# Altium project Individual Assignment.PrjPcb
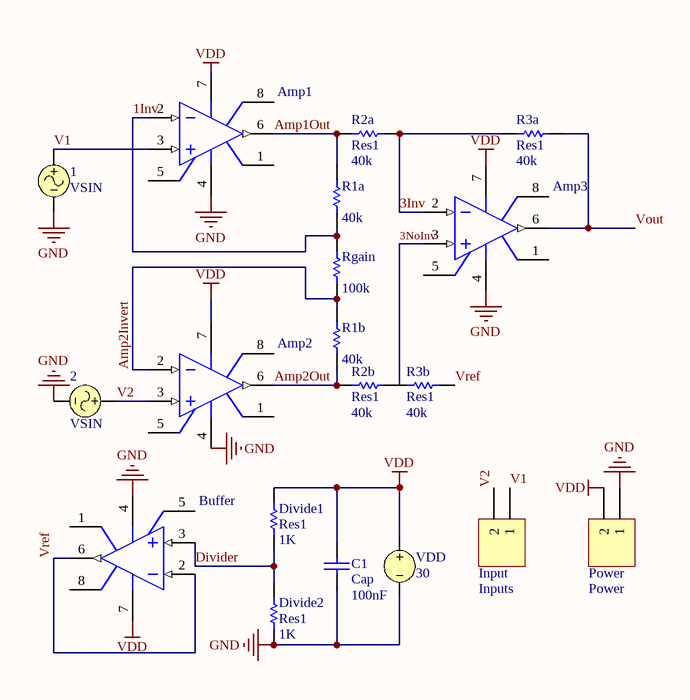
[diagram p0: Sheet1.SchDoc]
1 sheet, 19 parts. Net scope: global (net labels, ports and power ports of the same name join across sheets).
Board file: PCB1.PcbDoc

## Sheet Sheet1.SchDoc
size A

### Parts
1  VSIN
2  VSIN
Amp1  Op Amp  [H-08A]  (value not drawn)
Amp2  Op Amp  [H-08A]  (value not drawn)
Amp3  Op Amp  [H-08A]  (value not drawn)
Buffer  Op Amp  [H-08A]  (value not drawn)
C1  Cap  value 100nF  [RAD-0.3]
Divide1  Res1  value 1K  [AXIAL-0.3]
Divide2  Res1  value 1K  [AXIAL-0.3]
Input  Inputs  [HDR1X2]
Power  Power  [HDR1X2]
R1a  40k  [AXIAL-0.3]
R1b  40k  [AXIAL-0.3]
R2a  Res1  value 40k  [AXIAL-0.3]
R2b  Res1  value 40k  [AXIAL-0.3]
R3a  Res1  value 40k  [AXIAL-0.3]
R3b  Res1  value 40k  [AXIAL-0.3]
Rgain  100k  [AXIAL-0.3]
VDD  30

### Nets
GND: 1.2 2.2 Amp1.4(V-) Amp2.4(V-) Amp3.4(V-) Buffer.4(V-) C1.2 Divide2.1 Power.1 VDD.2
VDD: Amp1.7(V+) Amp2.7(V+) Amp3.7(V+) Buffer.7(V+) C1.1 Divide1.2 Power.2 VDD.1
1Inv: Amp1.2(IN-) R1a.1 Rgain.2
3Inv: Amp3.2(IN-) R2a.2 R3a.1
3NoInv: Amp3.3(IN+) R2b.2
Amp1Out: Amp1.6(OUT) R1a.2 R2a.1
Amp2Invert: Amp2.2(IN-) R1b.2 Rgain.1
Amp2Out: Amp2.6(OUT) R1b.1 R2b.1
Divider: Buffer.3(IN+) Divide1.1 Divide2.2
V1: 1.1 Amp1.3(IN+) Input.1
V2: 2.1 Amp2.3(IN+) Input.2
Vout: Amp3.6(OUT) R3a.2
Vref: Buffer.2(IN-) Buffer.6(OUT) R3b.2

Not connected (* = marked no-connect by the designer): Amp1 1(OS_NUL) 5(OS_NUL) 8(TAB); Amp2 1(OS_NUL) 5(OS_NUL) 8(TAB); Amp3 1(OS_NUL) 5(OS_NUL) 8(TAB); Buffer 1(OS_NUL) 5(OS_NUL) 8(TAB); R3b 1

### Library data of the parts
1 2 = VSIN: Sinusoidal Voltage Source; Note: PCB Footprint - Not required; Published: 8-Jun-2000; LatestRevisionDate: 15-Nov-2004; LatestRevisionNote: Corrected Netlist.; PackageReference: Not Applicable; Publisher: Altium Limited
Amp1-Amp3 Buffer = Op Amp: FET Operational Amplifier; Published: 8-Jun-2000; LatestRevisionDate: 17-Jul-2002; LatestRevisionNote: Re-released for DXP Platform.; DatasheetVersion: REV. B; PackageVersion: 1990; PackageReference: H-08A; Publisher: Altium Limited; PackageDescription: Can; 8 Leads; Pin Circle Dia. 5.08 mm; Lead Dia. 0.53 mm (max); ComponentLink1Description: Manufacturer Link; ComponentLink1URL: http://www.analog.com/
C1 = Cap: Capacitor; Published: 8-Jun-2000; LatestRevisionDate: 17-Jul-2002; LatestRevisionNote: Re-released for DXP Platform.; PackageReference: RAD-0.3; Publisher: Altium Limited; PackageDescription: Radial Cap, Thru-Hole; 2 Leads; 0.3 in Pin Spacing
Divide1 Divide2 R1a R1b R2a R2b R3a R3b Rgain = Res1: Resistor; Published: 8-Jun-2000; LatestRevisionDate: 17-Jul-2002; LatestRevisionNote: Re-released for DXP Platform.; PackageReference: AXIAL-0.3; Publisher: Altium Limited; PackageDescription: Axial Device, Thru-Hole; 2 Leads; 0.3 in Pin Spacing
  R1a R1b: Value: 40k
  Rgain: Value: 100k
Input Power = Header 2: Header, 2-Pin; LatestRevisionDate: 17-Jul-2002; LatestRevisionNote: Re-released for DXP Platform.; Publisher: Altium Limited
VDD = VSRC: Voltage Source; Note: PCB Footprint - Not required; Published: 8-Jun-2000; LatestRevisionDate: 17-Jul-2002; LatestRevisionNote: Re-released for DXP Platform.; PackageReference: Not Applicable; Publisher: Altium Limited; Value: 30